# Altium schematic sheet HIVE_BOARD_TITLE.SchDoc
size Tabloid; DocumentNumber: 1; SheetNumber: 1; SheetTotal: 12; Sheet_Name: Insert name in Document Parameters; Size: 11x17
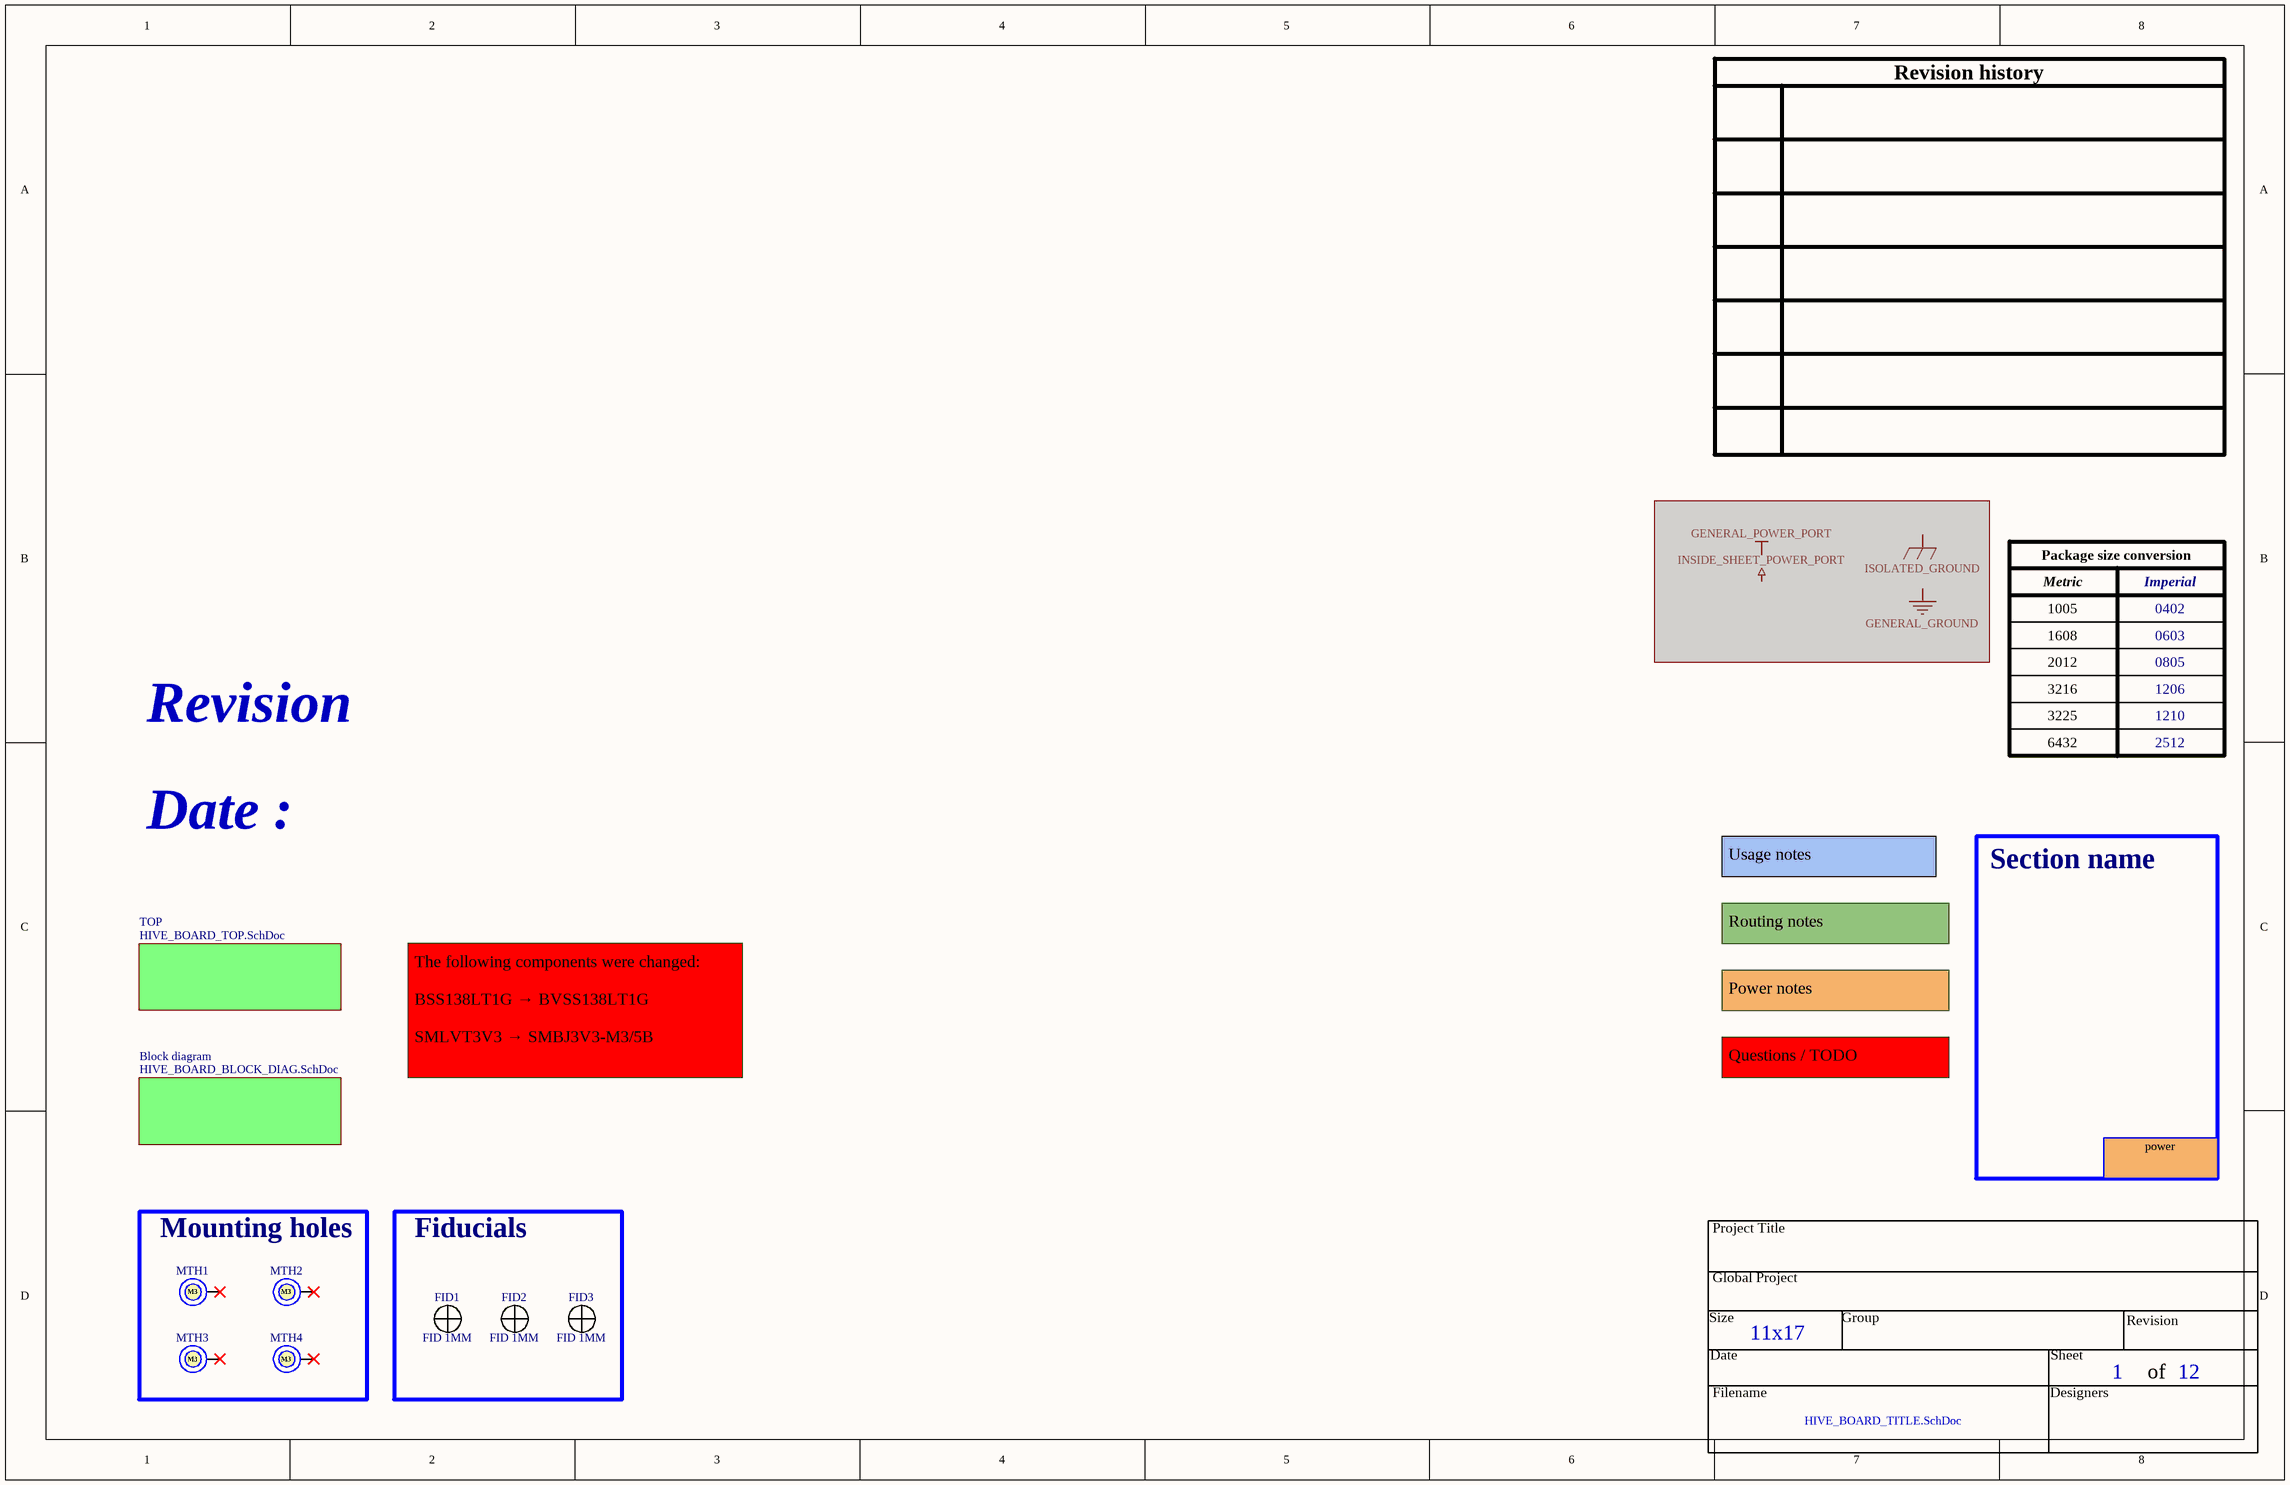
[diagram p0: HIVE_BOARD_TITLE.SchDoc]

## Parts
FID1  FID 1MM  [FID_CIRCLE_1MM]
FID2  FID 1MM  [FID_CIRCLE_1MM]
FID3  FID 1MM  [FID_CIRCLE_1MM]
MTH1  M3  [MTH_M3]  (no BOM)
MTH2  M3  [MTH_M3]  (no BOM)
MTH3  M3  [MTH_M3]  (no BOM)
MTH4  M3  [MTH_M3]  (no BOM)

## Blocks framed on the sheet
Mounting holes: MTH1-MTH4
Fiducials: FID1-FID3

## Sub-sheets
Block diagram = HIVE_BOARD_BLOCK_DIAG.SchDoc: no entries
TOP = HIVE_BOARD_TOP.SchDoc: no entries

## Nets

Not connected (* = marked no-connect by the designer): FID1 1 2; FID2 1 2; FID3 1 2; MTH1 1*; MTH2 1*; MTH3 1*; MTH4 1*

## Notes on the sheet
- Usage notes
- Section name
- Routing notes
- Power notes
- The following components were changed:
  BSS138LT1G → BVSS138LT1G
  SMLVT3V3 → SMBJ3V3-M3/5B
- Questions / TODO
- power
- Revision history
- Package size conversion
- Metric
- 1005
- 1608
- Imperial
- 0402
- 0603
- Revision
- 2012
- 3216
- 0805
- 1206
- 3225
- 6432
- 1210
- 2512
- Date :
- Project Title
- Global Project
- Size
- Date
- Group
- Sheet
- of
- Filename
- Designers

## Library data of the parts
FID1-FID3 = FID_CIRCLE_1MM: FID - FIDUCIAL 1MM CIRCLE DOUBLE-SIDED - 1MM; GRAMS Lib Spec: 2.8; Magnetic Material: NO; Value: *; Tolerance: *; Voltage Rating: *; Current Rating: *; Power Max: *; HelpURL: https://www.pcb-3d.com/wordpress/wp-content/uploads/ipc-sm-782a_amendment_1_and_2.pdf; CreatedBy/Date: Jonathan Bouchard 2018-07-23; VerifiedBy: Caroline Paulin - 25 juillet 2018; Temperature: *; Package: 1MM CIRCLE; Manufacturer #1: *; Manufacturer #2: *; Note: *; Assembly Type: NONE; Part Number #2: *; Part Number #1: *; Polarized: *; Supplier 1: *; Supplier Part Number 1: *
MTH1-MTH4 = MTH_M3: MTH - MOUNTING HOLE M3 PLATED - M3; GRAMS Lib Spec: 2.8; Magnetic Material: NO; Cryo: UNKNOWN; Value: *; Tolerance: *; Voltage Rating: *; Current Rating: *; Power Max: *; HelpURL: https://littlemachineshop.com/images/gallery/PDF/TapDrillSizes.pdf; CreatedBy/Date: Jonathan Bouchard 2018-07-23; VerifiedBy: Arnaud Samson 23-07-18; Temperature: *; Package: M3; Manufacturer #1: *; Manufacturer #2: *; Note: *; Assembly Type: NONE; Part Number #2: *; Part Number #1: *; Polarized: *; Supplier 1: *; Supplier Part Number 1: *